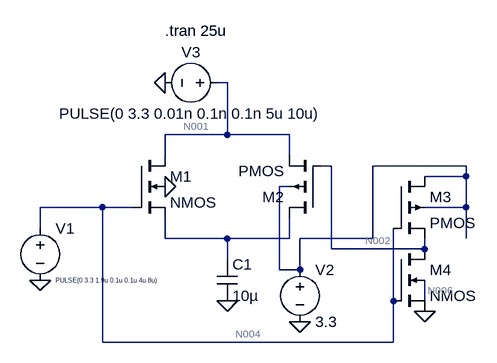
[diagram p0: schematic Draft1.asc]
Draft1.asc, the LTspice schematic file:
Version 4
SHEET 1 880 680
WIRE 192 16 176 16
WIRE 192 96 192 16
WIRE 192 96 96 96
WIRE 288 96 192 96
WIRE 96 128 96 96
WIRE 288 128 288 96
WIRE 352 144 336 144
WIRE 560 144 416 144
WIRE 560 160 560 144
WIRE 560 160 496 160
WIRE 288 176 272 176
WIRE 0 208 -96 208
WIRE 48 208 0 208
WIRE 560 208 560 160
WIRE 560 208 496 208
WIRE -96 240 -96 208
WIRE 96 256 96 224
WIRE 192 256 96 256
WIRE 288 256 288 224
WIRE 288 256 192 256
WIRE 416 256 416 144
WIRE 416 256 304 256
WIRE 560 256 560 208
WIRE 352 272 352 144
WIRE 496 272 496 256
WIRE 496 272 352 272
WIRE 192 288 192 256
WIRE 272 304 272 176
WIRE 304 304 304 256
WIRE 304 304 272 304
WIRE 448 352 448 240
WIRE 496 352 496 320
WIRE 0 416 0 208
WIRE 448 416 448 352
WIRE 448 416 0 416
FLAG -96 320 0
FLAG 192 352 0
FLAG 304 384 0
FLAG 496 368 0
FLAG 96 16 0
FLAG 96 176 0
SYMBOL voltage -96 224 R0
WINDOW 3 24 96 Left 0
WINDOW 123 0 0 Left 0
WINDOW 39 0 0 Left 0
SYMATTR InstName V1
SYMATTR Value PULSE(0 3.3 1.9u 0.1u 0.1u 4u 8u)
SYMBOL voltage 304 288 R0
WINDOW 123 0 0 Left 0
WINDOW 39 0 0 Left 0
SYMATTR InstName V2
SYMATTR Value 3.3
SYMBOL voltage 192 16 R90
WINDOW 0 -32 56 VBottom 2
WINDOW 3 32 56 VTop 2
WINDOW 123 0 0 Left 0
WINDOW 39 0 0 Left 0
SYMATTR InstName V3
SYMATTR Value PULSE(0 3.3 0.01n 0.1n 0.1n 5u 10u)
SYMBOL cap 176 288 R0
SYMATTR InstName C1
SYMATTR Value 10µ
SYMBOL nmos4 48 128 R0
SYMATTR InstName M1
SYMBOL pmos4 336 224 R180
SYMATTR InstName M2
SYMBOL pmos4 448 160 R0
SYMATTR InstName M3
SYMBOL nmos4 448 272 R0
SYMATTR InstName M4
TEXT 96 -64 Left 2 !.tran 25u

The netlist it stands for:
* Draft1.asc
V1 N004 0 PULSE(0 3.3 1.9u 0.1u 0.1u 4u 8u)
V2 N003 0 3.3
V3 N001 0 PULSE(0 3.3 0.01n 0.1n 0.1n 5u 10u)
C1 N005 0 10µ
M1 N001 N004 N005 0 NMOS
M2 N005 N002 N001 N003 PMOS
M3 N003 N004 N002 N003 PMOS
M4 N002 N004 0 N006 NMOS
.model NMOS NMOS
.model PMOS PMOS
.lib standard.mos
.tran 25u
.backanno
.end

* Results of the author's LTspice run, read from the files saved beside the schematic
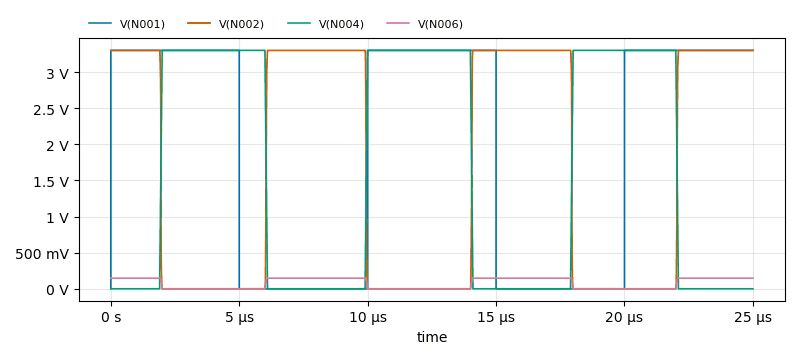
[diagram p1: Transient Analysis of Draft1.asc, plotted from the saved traces]
* Transient Analysis, 1 run:
*   V(N001): min 0 V, max 3.3 V, average 1.98 V, rms 2.556 V, last 3.3 V
*   V(N002): min 0 V, max 3.3 V, average 1.676 V, rms 2.347 V, last 3.3 V
*   V(N004): min 0 V, max 3.3 V, average 1.624 V, rms 2.306 V, last 0 V
*   V(N006): min 36.8 nV, max 146.5 mV, average 74.87 mV, rms 104.5 mV, last 146.5 mV